# Altium schematic sheet [17] - PWR IN, LEDS, BUTTONS, MECH.SchDoc
size A3; DocumentNumber: 2; SheetNumber: 17; SheetTotal: 20
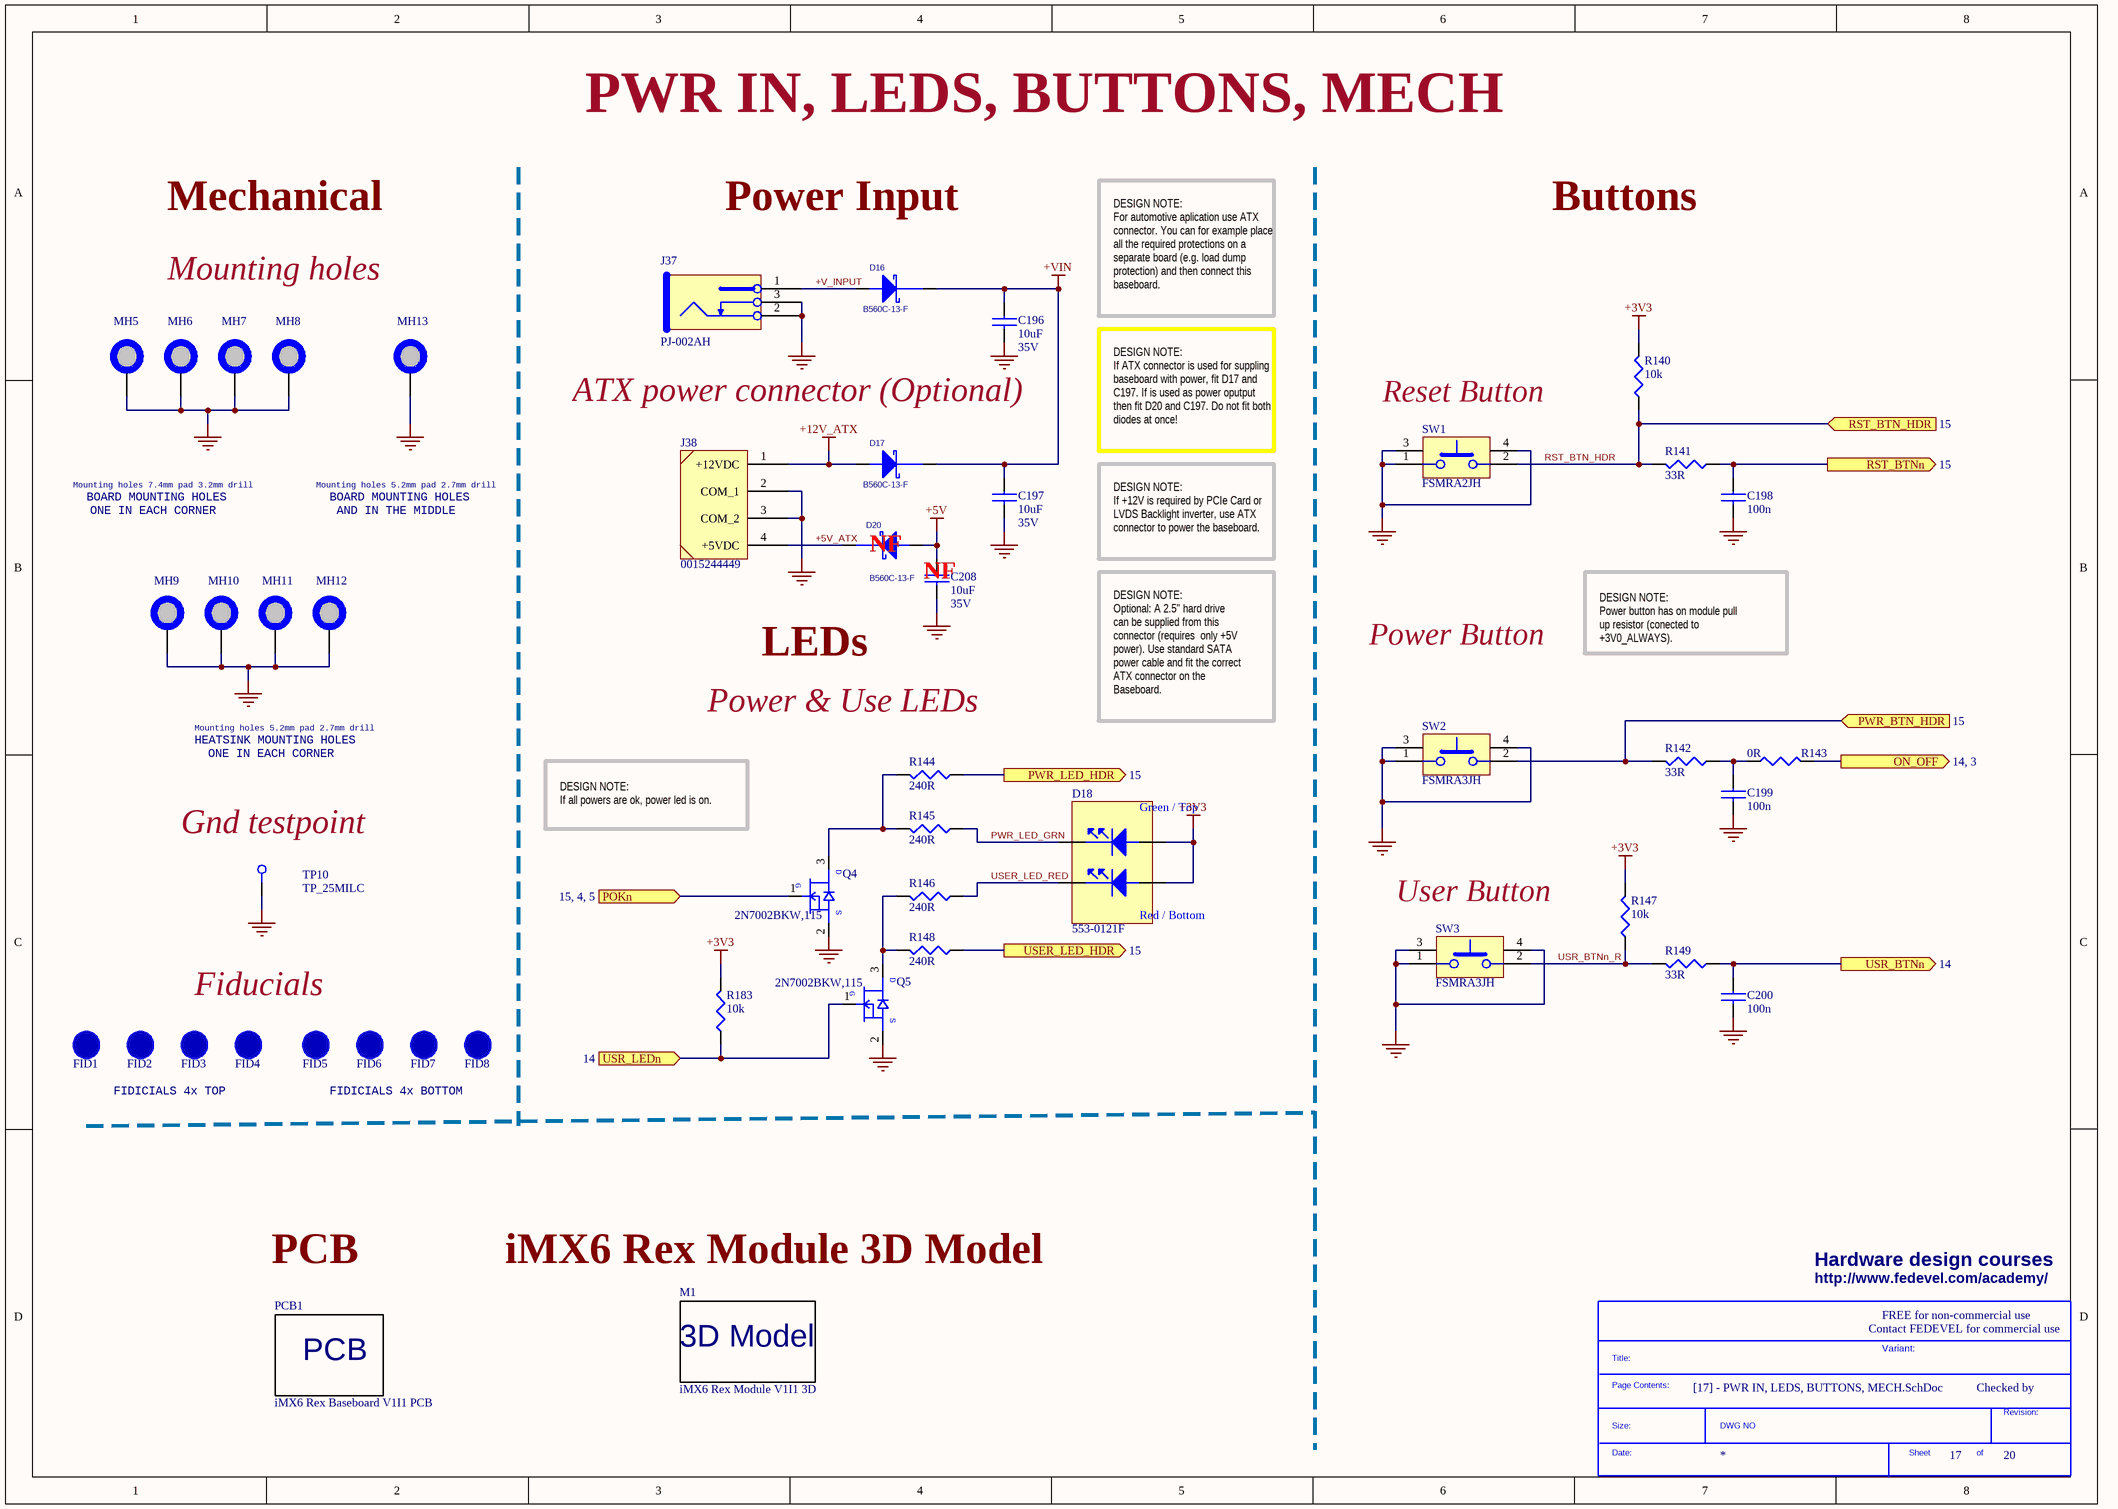
[diagram p0: [17] - PWR IN, LEDS, BUTTONS, MECH.SchDoc]

## Parts
*  SDTitleBlock  (value not drawn)  (graphical)
C196  10uF  Voltage - Rated: 35V  [C1206]
C197  10uF  Voltage - Rated: 35V  [C1206]
C198  100n  [C0402]
C199  100n  [C0402]
C200  100n  [C0402]
C208  10uF  Voltage - Rated: 35V  [C1206]
D16  B560C-13-F  [SMC]
D17  B560C-13-F  [SMC]
D18  553-0121F  [553-0121F]
D20  B560C-13-F  [SMC]
FID1  FID_1MMC  [FID_40X120D]  (value not drawn)  (no BOM)
FID2  FID_1MMC  [FID_40X120D]  (value not drawn)  (no BOM)
FID3  FID_1MMC  [FID_40X120D]  (value not drawn)  (no BOM)
FID4  FID_1MMC  [FID_40X120D]  (value not drawn)  (no BOM)
FID5  FID_1MMC  [FID_40X120D]  (value not drawn)  (no BOM)
FID6  FID_1MMC  [FID_40X120D]  (value not drawn)  (no BOM)
FID7  FID_1MMC  [FID_40X120D]  (value not drawn)  (no BOM)
FID8  FID_1MMC  [FID_40X120D]  (value not drawn)  (no BOM)
J37  PJ-002AH  [POWER_JACK_5.5_2.1MM_NS]
J38  0015244449  [015244449]
M1  iMX6 Rex Module V1I1 3D  [iMX6 Rex Module 3D]  (no BOM)
MH5  MH_7.4MMC_3.2MMD  [MH_7.4MMD_3.2MMD]  (value not drawn)  (no BOM)
MH6  MH_7.4MMC_3.2MMD  [MH_7.4MMD_3.2MMD]  (value not drawn)  (no BOM)
MH7  MH_7.4MMC_3.2MMD  [MH_7.4MMD_3.2MMD]  (value not drawn)  (no BOM)
MH8  MH_7.4MMC_3.2MMD  [MH_7.4MMD_3.2MMD]  (value not drawn)  (no BOM)
MH9  MH_5.2MMC_2.7MMD  [MH_5.2MMD_2.7MMD]  (value not drawn)  (no BOM)
MH10  MH_5.2MMC_2.7MMD  [MH_5.2MMD_2.7MMD]  (value not drawn)  (no BOM)
MH11  MH_5.2MMC_2.7MMD  [MH_5.2MMD_2.7MMD]  (value not drawn)  (no BOM)
MH12  MH_5.2MMC_2.7MMD  [MH_5.2MMD_2.7MMD]  (value not drawn)  (no BOM)
MH13  MH_5MMC_2.2MMD  [MH_5MMD_2.2MMD]  (value not drawn)  (no BOM)
PCB1  iMX6 Rex Baseboard V1I1 PCB  (mechanical)
Q4  2N7002BKW,115  [SC70_SOT323]
Q5  2N7002BKW,115  [SC70_SOT323]
R140  10k  [R0402]
R141  33R  [R0402]
R142  33R  [R0402]
R143  0R  [R0402]
R144  240R  [R0402]
R145  240R  [R0402]
R146  240R  [R0402]
R147  10k  [R0402]
R148  240R  [R0402]
R149  33R  [R0402]
R183  10k  [R0402]
SW1  FSMRA2JH  [FSMRA2JH]
SW2  FSMRA3JH  [FSMRA3JH]
SW3  FSMRA3JH  [FSMRA3JH]
TP10  TP_25MILC  [TP_25C]  (no BOM)

## Ports
ON_OFF (out, see 14, 3), POKn (see 15, 4, 5), PWR_BTN_HDR (in, see 15), PWR_LED_HDR (out, see 15), RST_BTN_HDR (in, see 15), RST_BTNn (out, see 15), USER_LED_HDR (out, see 15), USR_BTNn (out, see 14), USR_LEDn (in, see 14)

## Nets
+3V3: D18.2(ANODE) D18.4(ANODE) R140.2 R147.2 R183.2
+5V: C208.1 D20.2(ANODE)
+12V_ATX: D17.2(ANODE) J38.1(+12VDC)
+VIN: C196.1 C197.1 D16.1(cathode) D17.1(cathode)
GND: C196.2 C197.2 C198.2 C199.2 C200.2 C208.2 J37.2 J37.3 J38.2(COM_1) J38.3(COM_2) MH5.1 MH6.1 MH7.1 MH8.1 MH9.1 MH10.1 MH11.1 MH12.1 MH13.1 Q4.2(SOURCE) Q5.2(SOURCE) SW1.1 SW1.3(MECH1) SW1.4(MECH2) SW2.1 SW2.3(MECH1) SW2.4(MECH2) SW3.1 SW3.3(MECH1) SW3.4(MECH2) TP10.1
+5V_ATX: D20.1(cathode) J38.4(+5VDC)
+V_INPUT: D16.2(ANODE) J37.1
ON_OFF: R143.2 ; port ON_OFF
POKn: Q4.1(GATE) ; port POKn
PWR_BTN_HDR: R142.2 SW2.2 ; port PWR_BTN_HDR
PWR_LED_GRN: D18.3(cathode) R145.1
PWR_LED_HDR: R144.1 ; port PWR_LED_HDR
RST_BTN_HDR: R140.1 R141.2 SW1.2 ; port RST_BTN_HDR
RST_BTNn: C198.1 R141.1 ; port RST_BTNn
USER_LED_HDR: R148.1 ; port USER_LED_HDR
USER_LED_RED: D18.1(cathode) R146.1
USR_BTNn: C200.1 R149.1 ; port USR_BTNn
USR_BTNn_R: R147.1 R149.2 SW3.2
USR_LEDn: Q5.1(GATE) R183.1 ; port USR_LEDn
NetC199_1: C199.1 R142.1 R143.1
NetQ4_3: Q4.3(DRAIN) R144.2 R145.2
NetQ5_3: Q5.3(DRAIN) R146.2 R148.2

## Notes on the sheet
- PWR IN, LEDS, BUTTONS, MECH
- Mechanical
- Power Input
- Buttons
- Mounting holes
- DESIGN NOTE:
  For automotive aplication use ATX connector. You can for example place all the required protections on a separate board (e.g. load dump protection) and then connect this baseboard.
- ATX power connector (Optional)
- DESIGN NOTE:
  If ATX connector is used for suppling baseboard with power, fit D17 and C197. If is used as power oputput then fit D20 and C197. Do not fit both diodes at once!
- (near SW1) Reset Button
- Mounting holes 7.4mm pad 3.2mm drill
- BOARD MOUNTING HOLES
- ONE IN EACH CORNER
- Mounting holes 5.2mm pad 2.7mm drill
- AND IN THE MIDDLE
- (near D20) NF
- (near C208) NF
- DESIGN NOTE:
  If +12V is required by PCIe Card or LVDS Backlight inverter, use ATX connector to power the baseboard.
- Power Button
- DESIGN NOTE:
  Power button has on module pull
  up resistor (conected to
  +3V0_ALWAYS).
- Power & Use LEDs
- LEDs
- DESIGN NOTE:
  Optional: A 2.5" hard drive
  can be supplied from this
  connector (requires  only +5V
  power). Use standard SATA
  power cable and fit the correct
  ATX connector on the
  Baseboard.
- HEATSINK MOUNTING HOLES
- (near TP10) Gnd testpoint
- DESIGN NOTE:
  If all powers are ok, power led is on.
- User Button
- Fiducials
- FIDICIALS 4x TOP
- FIDICIALS 4x BOTTOM
- Hardware design courses
- PCB
- iMX6 Rex Module 3D Model
- http://www.fedevel.com/academy/
- Contact FEDEVEL for commercial use
- FREE for non-commercial use
- Variant:
- Checked by
- (in symbol 2N7002BKW,115) D; G; S
- (in symbol 553-0121F) Green / Top; Red / Bottom
- (in symbol PCB_iMX6_REX_Baseboard_V1I1) PCB
- (in symbol SDTitleBlock) Title:; Page Contents:; Revision:; Size:; DWG NO; Date:; Sheet; of

## Library data of the parts
C196 C197 C208 = GRM31CR6YA106KA12L: CAP CER 10UF 35V X5R 1206; Manufacturer: Murata Electronics North America; Capacitance: 10µF; .Checked PCB: used; Description: CAP CER 10UF 35V 10% X5R 1206; Tolerance: ±10%; Category: Capacitors; Supplier Part Number: 490-5524-1-ND; Manufacturer Part Number: GRM31CR6YA106KA12L; Operating Temperature: -55°C ~ 85°C; Package / Case: 1206 (3216 Metric); Price 1k [$]: 0.19448; Value: 10uF; .Checked SCH: used; Supplier: Digikey; Supplier 1: Digi-Key; Supplier Part Number 1: 490-5524-1-ND; RoHS: RoHS Compliant; Stock 1: 76334; Pricing 1: 1=0.6, 10=0.501, 50=0.359, 100=0.3142, 250=0.24684, 500=0.2244, 1000=0.17952 (USD); Temperature Coefficient: X5R; Mounting Type: Surface Mount, MLCC; Applications: General Purpose; Ratings: -; Size / Dimension: 0.126" L x 0.063" W (3.20mm x 1.60mm); Height - Seated (Max): -; Thickness (Max): 0.071" (1.80mm); Lead Spacing: -; Features: -; Packaging: Cut Tape (CT); Lead Style: -; ComponentLink1URL: http://www.murata.com/products/catalog/pdf/c02e.pdf; ComponentLink1Description: http://www.murata.com/products/catalog/pdf/c02e.pdf
C198-C200 = C1005X5R1H104K: CAP CER .10UF 50V X5R 10% 0402; Manufacturer: TDK Corporation; Capacitance: 0.1µF; Value: 100nF; .Checked PCB: used; Description: CAP CER 0.1UF 50V 10% X5R 0402; Category: Capacitors; Supplier Part Number: 445-5942-1-ND; Manufacturer Part Number: C1005X5R1H104K; Operating Temperature: -55°C ~ 85°C; Package / Case: 0402 (1005 Metric); Price 1k [$]: 0.02340; .Checked SCH: used; Voltage - Rated: 50V; Supplier: Digikey; Supplier 1: Digi-Key; Supplier Part Number 1: 445-5942-1-ND; RoHS: RoHS Compliant; Stock 1: 106926; Pricing 1: 1=0.27, 10=0.18, 100=0.072, 250=0.05176, 500=0.0369, 1000=0.027 (USD); Tolerance: ±10%; Temperature Coefficient: X5R; Mounting Type: Surface Mount, MLCC; Applications: General Purpose; Ratings: -; Size / Dimension: 0.039" L x 0.020" W (1.00mm x 0.50mm); Height - Seated (Max): -; Thickness (Max): 0.022" (0.55mm); Lead Spacing: -; Features: -; Packaging: Cut Tape (CT); Lead Style: -; ComponentLink1URL: http://www.tdk.co.jp/tefe02/e412_c.pdf; ComponentLink1Description: http://www.tdk.co.jp/tefe02/e412_c.pdf
D16 D17 D20 = B560C-13-F: DIODE SCHOTTKY 60V 5A SMC; Manufacturer: Diodes Inc; .Checked PCB: used; Voltage - Forward (Vf) (Max) @ If: 700mV @ 5A; Speed: Fast Recovery =< 500ns, > 200mA (Io); Current - Reverse Leakage @ Vr: 500µA @ 60V; Capacitance @ Vr, F: 300pF @ 4V, 1MHz; .Checked SCH: used; Category: Discrete Semiconductor Products; Supplier Part Number: B560C-FDICT-ND; Manufacturer Part Number: B560C-13-F; Price 1k [$]: 0.42900; Value: B560C-13-F; Package / Case: DO-214AB, SMC; Supplier: Digikey; Family: Diodes, Rectifiers - Single; Voltage - DC Reverse (Vr) (Max): 60V; Current - Average Rectified (Io): 5A; Diode Type: Schottky; Supplier 1: Digi-Key; Supplier Part Number 1: B560C-FDICT-ND; RoHS: RoHS Compliant; Stock 1: 37770; Pricing 1: 1=0.99, 10=0.884, 100=0.702, 250=0.611, 500=0.546, 1000=0.429 (USD); Reverse Recovery Time (trr): -; Mounting Type: Surface Mount; Supplier Device Package: SMC; Packaging: Cut Tape (CT); ComponentLink1URL: http://www.diodes.com/datasheets/ds13012.pdf; ComponentLink1Description: http://www.diodes.com/datasheets/ds13012.pdf
D18 = 553-0121F: LED 2HI 3MM GREEN OVER RED PCMNT; Manufacturer: Dialight; .Checked PCB: used; Color: Green, Red; Wavelength - Peak: 563nm, 650nm; Voltage Rating: 2.1V Green, 2V Red; Current: 10mA; Millicandela Rating: 16mcd Green, 10mcd Red; Lens Type: Diffused, Tinted; Lens Style/Size: Round with Domed Top, 3mm; Configuration: 2 High; .Checked SCH: used; Category: Optoelectronics; Family: LEDs - Circuit Board Indicators, Arrays, Light Bars, Bar Graphs; Manufacturer Part Number: 553-0121F; Price 1k [$]: 0.63000; Supplier: Digikey; Supplier Part Number: 350-1822-ND; Value: 553-0121F; Supplier 1: Digi-Key; Supplier Part Number 1: 350-1822-ND; RoHS: RoHS Compliant; Stock 1: 5551; Pricing 1: 1=1.68, 25=1.05, 100=0.945, 250=0.84, 500=0.714, 1000=0.588, 5000=0.525 (USD); Viewing Angle: -; Mounting Type: Through Hole, Right Angle; Packaging: Bulk; ComponentLink1URL: http://www.dialight.com/Assets/Drawings/2D_Drawings_DrawingDetailedSpec/C17277.pdf; ComponentLink1Description: http://www.dialight.com/Assets/Drawings/2D_Drawings_DrawingDetailedSpec/C17277.pdf
FID1-FID8 = FID_1MMC: Fiducial 40mil Diameter, 120mil Mask; Supplier: Digikey
J37 = PJ-002AH: CONN PWR JACK 2.1X5.5MM HIGH CUR; Manufacturer: CUI Inc; .Checked PCB: used; Mating connector: 2.1mm ID, 5.5mm OD; Gender: Male; Number of Positions/Contacts: 2 Conductors, 3 Contacts; Internal Switch(s): Single Switch, Normally Closed; Shielding: Unshielded; Voltage - Rated: 24VDC; Current Rating: 5A; .Checked SCH: used; Category: Connectors, Interconnects; Family: Barrel - Power; Manufacturer Part Number: PJ-002AH; Operating Temperature: -25°C ~ 85°C; Price 1k [$]: 0.23625; Supplier: Digikey; Supplier Part Number: CP-002AH-ND; Value: PJ-002AH; Supplier 1: Digi-Key; Supplier Part Number 1: CP-002AH-ND; RoHS: RoHS Compliant; Stock 1: 138933; Pricing 1: 1=1.01, 10=0.704, 100=0.4724, 500=0.3819, 1000=0.3417, 2500=0.27135 (USD); Connector Type: Jack; Plug/Mating Plug Diameter: 2.1mm ID, 5.5mm OD; Mounting Type: Through Hole, Right Angle; Termination: Solder Eyelet(s); Features: -; Color: Black; Contact Material: Copper Alloy; Contact Material - Plating: Nickel; Housing Color: Black; Housing Material: Thermoplastic; ComponentLink1URL: http://products.cui.com/GetSpecForDigiKey.aspx?MFGNum=PJ-002AH; ComponentLink1Description: http://products.cui.com/GetSpecForDigiKey.aspx?MFGNum=PJ-002AH
J38 = 0015244449: CONN HEADER 4POS .200 VERT; Manufacturer: Molex Inc; Connector Type: Header, Shrouded; Number of Positions: 4; Number of Positions Loaded: All; Pitch: 0.200" (5.08mm); .Creator: MM; Supplier 1: Digi-Key; Manufacturer Part Number: 0015244449; RoHS: RoHS Compliant; Category: Connectors, Interconnects; Stock 1: 933; Pricing 1: 1=0.83, 10=0.729, 25=0.6864, 50=0.6578, 100=0.6292, 250=0.572, 500=0.5148, 1000=0.4576, 2500=0.4147 (USD); Packaging: Tray; Contact Type: Male Pin; Number of Rows: 1; Row Spacing: -; Contact Mating Length: 0.171" (4.34mm); Mounting Type: Through Hole; Termination: Solder; Fastening Type: Locking Ramp; Features: -; Contact Finish: Tin; Contact Finish Thickness: 100µin (2.54µm); Color: Beige; ComponentLink1URL: http://www.molex.com/pdm_docs/sd/015244449_sd.pdf; ComponentLink1Description: http://www.molex.com/pdm_docs/sd/015244449_sd.pdf; Supplier Part Number 1: WM9132-ND; .Checked PCB: MM; .Checked SCH: MM
M1 = 3D_iMX6_REX_MODULE_V1I1: Printed Circuit Board; .Creator: MM; Category: 3D Model
MH5-MH8 = MH_7.4MMC_3.2MMD: Mounting Hole 7.4mm Diameter, 3.2mm Drill
MH9-MH12 = MH_5.2MMC_2.7MMD: Mounting Hole 5.2mm Diameter, 2.7mm Drill; .Creator: MM
MH13 = MH_5MMC_2.2MMD: Mounting Hole 5mm Diameter, 2.2mm Drill
PCB1 = PCB_iMX6_REX_Baseboard_V1I1: Printed Circuit Board; .Creator: MM; Category: Printed circuits board; .Checked SCH: MM
Q4 Q5 = 2N7002BKW,115: MOSFET N-CH 60V 310MA SOT323; Manufacturer: NXP Semiconductors; FET Type: MOSFET N-Channel, Metal Oxide; FET Feature: Logic Level Gate; Rds On (Max) @ Id, Vgs: 1.6 Ohm @ 500mA, 10V; Vgs(th) (Max) @ Id: 2.1V @ 250µA; Gate Charge (Qg) @ Vgs: 0.6nC @ 4.5V; Input Capacitance (Ciss) @ Vds: 50pF @ 10V; Power - Max: 275mW; .Checked PCB: RF; Supplier 1: Digi-Key; Supplier Part Number 1: 568-5980-1-ND; Manufacturer Part Number: 2N7002BKW,115; RoHS: RoHS Compliant; Category: Discrete Semiconductor Products; Stock 1: 15666; Pricing 1: 1=0.39, 10=0.354, 25=0.2548, 100=0.1983, 250=0.12456, 500=0.10616, 1000=0.07233 (USD); Drain to Source Voltage (Vdss): 60V; Current - Continuous Drain (Id) @ 25° C: 310mA; Mounting Type: Surface Mount; Package / Case: SC-70, SOT-323; Supplier Device Package: SC-70; Packaging: Cut Tape (CT); ComponentLink1URL: http://www.nxp.com/documents/data_sheet/2N7002BKW.pdf; ComponentLink1Description: http://www.nxp.com/documents/data_sheet/2N7002BKW.pdf; .Checked SCH: RF
R140 R147 R183 = RC0402FR-0710KL: RES 10.0K OHM 1/16W 1% 0402 SMD; Manufacturer: Yageo; Power (Watts): 0.063W, 1/16W; .Checked PCB: used; Temperature Coefficient: ±100ppm/°C; Category: Resistors; Supplier Part Number: 311-10.0KLRCT-ND; Manufacturer Part Number: RC0402FR-0710KL; Package / Case: 0402 (1005 Metric); Price 1k [$]: 0.01421; Resistance (Ohms): 10K; Tolerance: ±1%; Value: 10k; .Checked SCH: used; Supplier: Digikey; Supplier 1: Digi-Key; Supplier Part Number 1: 311-10.0KLRCT-ND; RoHS: RoHS Compliant; Stock 1: 2916495; Pricing 1: 10=0.014, 50=0.0104, 100=0.0079, 250=0.00584, 500=0.00432, 1000=0.00288 (USD); Composition: Thick Film; Features: -; Size / Dimension: 0.039" L x 0.020" W (1.00mm x 0.50mm); Height: 0.016" (0.40mm); Number of Terminations: 2; Packaging: Cut Tape (CT); ComponentLink1URL: http://www.yageo.com/documents/recent/PYu-RC0402_51_RoHS_L_6.pdf; ComponentLink1Description: http://www.yageo.com/documents/recent/PYu-RC0402_51_RoHS_L_6.pdf
R141 R142 R149 = RMCF0402FT33R0: RES TF 33 OHM 1% 1/16W 0402; Manufacturer: Stackpole Electronics Inc; Resistance (Ohms): 33; Power (Watts): 0.063W, 1/16W; .Checked PCB: RF; Temperature Coefficient: ±100ppm/°C; Category: Resistors; Supplier Part Number: RMCF0402FT33R0CT-ND; Manufacturer Part Number: RMCF0402FT33R0; Package / Case: 0402 (1005 Metric); Price 1k [$]: 0.00384; Tolerance: ±1%; Value: 33R; .Checked SCH: RF; Supplier: Digikey; Supplier 1: Digi-Key; Supplier Part Number 1: RMCF0402FT33R0CT-ND; RoHS: RoHS Compliant; Stock 1: 26866; Pricing 1: 1=0.04, 10=0.025, 50=0.0138, 100=0.0105, 250=0.0078, 500=0.00576, 1000=0.00384 (USD); Composition: Thick Film; Features: -; Size / Dimension: 0.039" L x 0.020" W (1.00mm x 0.50mm); Height: 0.016" (0.40mm); Number of Terminations: 2; Packaging: Cut Tape (CT); ComponentLink1URL: http://www.seielect.com/Catalog/SEI-RMCF.pdf; ComponentLink1Description: http://www.seielect.com/Catalog/SEI-RMCF.pdf
R143 = RC0402JR-070RL: RES 0.0 OHM 1/16W 0402 SMD; Manufacturer: Yageo; Resistance (Ohms): 0.0; Power (Watts): 0.063W, 1/16W; Tolerance: Jumper; .Checked PCB: used; Category: Resistors; Supplier Part Number: 311-0.0JRCT-ND; Manufacturer Part Number: RC0402JR-070RL; Package / Case: 0402 (1005 Metric); Price 1k [$]: 0.01389; Value: 0R; .Checked SCH: used; Supplier: Digikey; Supplier 1: Digi-Key; Supplier Part Number 1: 311-0.0JRCT-ND; RoHS: RoHS Compliant; Stock 1: 1106330; Pricing 1: 10=0.012, 50=0.009, 100=0.0069, 250=0.00512, 500=0.0038, 1000=0.00253 (USD); Composition: Thick Film; Features: -; Temperature Coefficient: -; Size / Dimension: 0.039" L x 0.020" W (1.00mm x 0.50mm); Height: 0.016" (0.40mm); Number of Terminations: 2; Packaging: Cut Tape (CT); ComponentLink1URL: http://www.yageo.com/documents/recent/PYu-RC0402_51_RoHS_L_6.pdf; ComponentLink1Description: http://www.yageo.com/documents/recent/PYu-RC0402_51_RoHS_L_6.pdf
R144-R146 R148 = RMCF0402FT240R: RES TF 240 OHM 1% 0.0625W 0402; Manufacturer: Stackpole Electronics Inc; Resistance (Ohms): 240; Power (Watts): 0.063W, 1/16W; .Checked PCB: used; Temperature Coefficient: ±100ppm/°C; Category: Resistors; Supplier Part Number: RMCF0402FT240RCT-ND; Manufacturer Part Number: RMCF0402FT240R; Package / Case: 0402 (1005 Metric); Price 1k [$]: 0.00384; Tolerance: ±1%; Value: 240R; .Checked SCH: used; Supplier: Digikey; Supplier 1: Digi-Key; Supplier Part Number 1: RMCF0402FT240RCT-ND; RoHS: RoHS Compliant; Stock 1: 39860; Pricing 1: 1=0.04, 10=0.025, 50=0.0138, 100=0.0105, 250=0.0078, 500=0.00576, 1000=0.00384 (USD); Composition: Thick Film; Features: -; Size / Dimension: 0.039" L x 0.020" W (1.00mm x 0.50mm); Height: 0.016" (0.40mm); Number of Terminations: 2; Packaging: Cut Tape (CT); ComponentLink1URL: http://www.seielect.com/Catalog/SEI-RMCF.pdf; ComponentLink1Description: http://www.seielect.com/Catalog/SEI-RMCF.pdf
SW1 = FSMRA2JH: SWITCH TACTILE SPST-NO 0.05A 12V; Manufacturer: TE Connectivity; Switch Function: Off-Mom; Contact Rating @ Voltage: 0.05A @ 12VDC; Actuator Type: Standard; Actuator Height off PCB, from Pins: 3.86mm; Actuator Orientation: Side Actuated; Outline: 7.10mm x 7.00mm; Illumination: Non-Illuminated; Operating Force: 160gf; Actuator Material: Polybutylene Terephthalate (PBT); Switch Travel: 0.25mm; Mechanical Life: 100,000 Cycles; .Creator: MM; Supplier 1: Digi-Key; Manufacturer Part Number: FSMRA2JH; RoHS: RoHS Compliant; Category: Switches; Stock 1: 12215; Pricing 1: 1=0.16, 10=0.151, 25=0.146, 50=0.141, 100=0.1331, 250=0.12528, 500=0.12006, 1000=0.09135 (USD); Packaging: Bulk; Circuit: SPST-NO; Mounting Type: Through Hole, Right Angle; Termination Style: PC Pin; Illumination Voltage (Nominal): -; Illumination Type, Color: -; Ingress Protection: -; Features: -; Operating Temperature: -35°C ~ 85°C; ComponentLink1URL: http://media.digikey.com/pdf/Data%20Sheets/Tyco%20Electronics%20Alcoswitch%20PDFs/FSM%20Series.pdf; ComponentLink1Description: http://media.digikey.com/pdf/Data%20Sheets/Tyco%20Electronics%20Alcoswitch%20PDFs/FSM%20Series.pdf; Supplier Part Number 1: 450-1662-ND; .Checked PCB: MM; .Checked SCH: MM
SW2 SW3 = FSMRA3JH: SWITCH TACTILE SPST-NO 0.05A 12V; Manufacturer: TE Connectivity; Switch Function: Off-Mom; Contact Rating @ Voltage: 0.05A @ 12VDC; Actuator Type: Standard; Actuator Height off PCB, from Pins: 5.85mm; Actuator Orientation: Side Actuated; Outline: 7.10mm x 7.00mm; Illumination: Non-Illuminated; Operating Force: 160gf; Actuator Material: Polyamide (PA), Nylon; Switch Travel: 0.25mm; Mechanical Life: 100,000 Cycles; .Creator: MM; Supplier 1: Digi-Key; Manufacturer Part Number: FSMRA3JH; RoHS: RoHS Compliant; Category: Switches; Stock 1: 37985; Pricing 1: 1=0.15, 10=0.143, 25=0.1376, 50=0.1328, 100=0.1255, 250=0.11808, 500=0.11316, 1000=0.0861 (USD); Packaging: Bulk; Circuit: SPST-NO; Mounting Type: Through Hole, Right Angle; Termination Style: PC Pin; Illumination Voltage (Nominal): -; Illumination Type, Color: -; Ingress Protection: -; Features: -; Operating Temperature: -35°C ~ 85°C; ComponentLink1URL: http://www.te.com/commerce/DocumentDelivery/DDEController?Action=srchrtrv&DocNm=1825027&DocType=Customer+Drawing&DocLang=English; ComponentLink1Description: http://www.te.com/commerce/DocumentDelivery/DDEController?Action=srchrtrv&DocNm=1825027&DocType=Customer+Drawing&DocLang=English; Supplier Part Number 1: 450-1657-ND; .Checked PCB: MM; .Checked SCH: MM
TP10 = TP_25MILC: Test Point 25mil